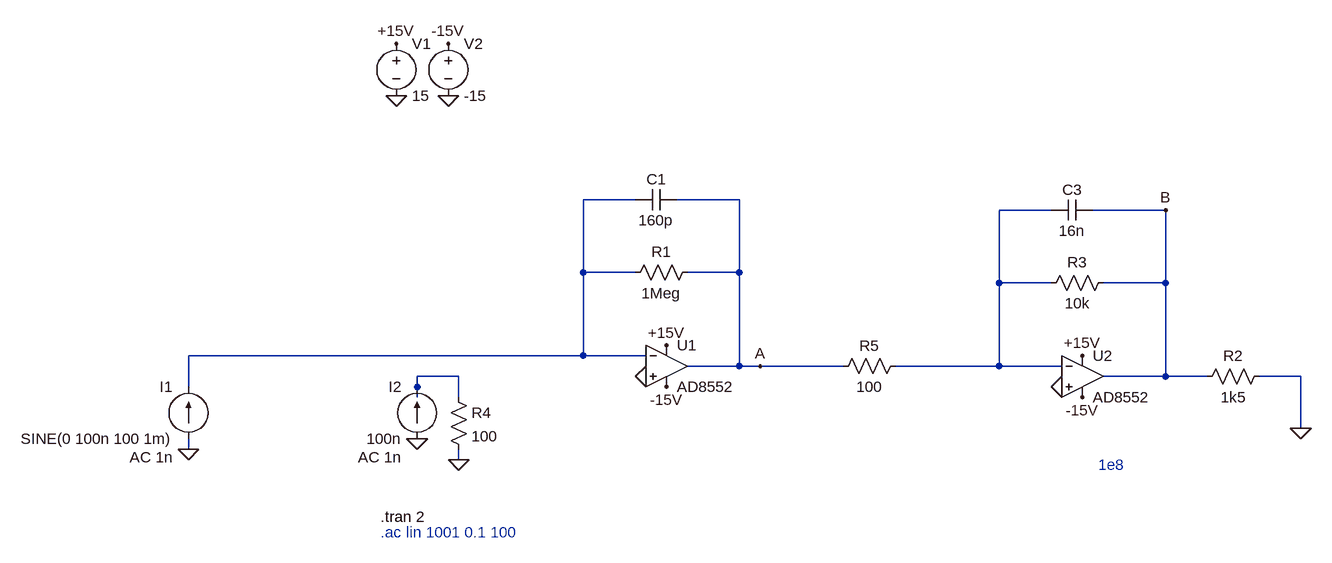
[diagram p0: schematic TIA1.asc]
TIA1.asc, the LTspice schematic file:
Version 4
SHEET 1 1732 1236
WIRE 256 128 176 128
WIRE 416 128 320 128
WIRE 896 144 816 144
WIRE 1072 144 960 144
WIRE 176 240 176 128
WIRE 256 240 176 240
WIRE 416 240 416 128
WIRE 416 240 336 240
WIRE 816 256 816 144
WIRE 896 256 816 256
WIRE 1072 256 1072 144
WIRE 1072 256 976 256
WIRE 176 368 176 240
WIRE 176 368 -432 368
WIRE 272 368 176 368
WIRE 416 384 416 240
WIRE 416 384 336 384
WIRE 448 384 416 384
WIRE 576 384 448 384
WIRE 816 384 816 256
WIRE 816 384 656 384
WIRE 912 384 816 384
WIRE -16 400 -80 400
WIRE 1072 400 1072 256
WIRE 1072 400 976 400
WIRE 1136 400 1072 400
WIRE 1280 400 1216 400
WIRE -432 416 -432 368
WIRE -80 416 -80 400
WIRE -80 432 -80 416
WIRE -16 432 -16 400
WIRE 1280 480 1280 400
WIRE -432 512 -432 496
WIRE -16 528 -16 512
FLAG -112 -32 0
FLAG -32 -32 0
FLAG 304 352 +15V
FLAG -112 -112 +15V
FLAG -32 -112 -15V
FLAG 304 416 -15V
FLAG 272 400 0
FLAG -432 512 0
FLAG 944 368 +15V
FLAG 944 432 -15V
FLAG 912 416 0
FLAG 448 384 A
FLAG 1072 144 B
FLAG -80 496 0
FLAG 1280 480 0
FLAG -16 528 0
SYMBOL OpAmps\\AD8552 304 320 R0
SYMATTR InstName U1
SYMBOL voltage -112 -128 R0
WINDOW 123 0 0 Left 0
WINDOW 39 0 0 Left 0
SYMATTR InstName V1
SYMATTR Value 15
SYMBOL voltage -32 -128 R0
WINDOW 123 0 0 Left 0
WINDOW 39 0 0 Left 0
SYMATTR InstName V2
SYMATTR Value -15
SYMBOL res 352 224 R90
WINDOW 0 0 56 VBottom 2
WINDOW 3 32 56 VTop 2
SYMATTR InstName R1
SYMATTR Value 1Meg
SYMBOL cap 320 112 R90
WINDOW 0 0 32 VBottom 2
WINDOW 3 32 32 VTop 2
SYMATTR InstName C1
SYMATTR Value 160p
SYMBOL current -432 496 R180
WINDOW 0 24 80 Left 2
WINDOW 3 24 0 Left 2
WINDOW 123 24 -28 Left 2
WINDOW 39 0 0 Left 0
SYMATTR InstName I1
SYMATTR Value SINE(0 100n 100 1m)
SYMATTR Value2 AC 1n
SYMBOL OpAmps\\AD8552 944 336 R0
SYMATTR InstName U2
SYMBOL res 992 240 R90
WINDOW 0 0 56 VBottom 2
WINDOW 3 32 56 VTop 2
SYMATTR InstName R3
SYMATTR Value 10k
SYMBOL cap 960 128 R90
WINDOW 0 0 32 VBottom 2
WINDOW 3 32 32 VTop 2
SYMATTR InstName C3
SYMATTR Value 16n
SYMBOL res 672 368 R90
WINDOW 0 0 56 VBottom 2
WINDOW 3 32 56 VTop 2
SYMATTR InstName R5
SYMATTR Value 100
SYMBOL current -80 496 R180
WINDOW 0 24 80 Left 2
WINDOW 3 24 0 Left 2
WINDOW 123 24 -28 Left 2
WINDOW 39 0 0 Left 0
SYMATTR InstName I2
SYMATTR Value 100n
SYMATTR Value2 AC 1n
SYMBOL res 1232 384 R90
WINDOW 0 0 56 VBottom 2
WINDOW 3 32 56 VTop 2
SYMATTR InstName R2
SYMATTR Value 1k5
SYMBOL res -32 416 R0
SYMATTR InstName R4
SYMATTR Value 100
TEXT -136 616 Left 2 !.tran 2
TEXT -136 640 Left 2 ;.ac lin 1001 0.1 100
TEXT 968 536 Left 2 ;1e8

The netlist it stands for:
* TIA1.asc
XU1 0 N001 +15V -15V A AD8552  ; pins In+ In- V+ V- OUT
V1 +15V 0 15
V2 -15V 0 -15
R1 A N001 1Meg
C1 A N001 160p
I1 0 N001 SINE(0 100n 100 1m) AC 1n
XU2 0 N002 +15V -15V B AD8552  ; pins In+ In- V+ V- OUT
R3 B N002 10k
C3 B N002 16n
R5 N002 A 100
I2 0 N003 100n AC 1n
R2 0 B 1k5
R4 N003 0 100
.tran 2
* .ac lin 1001 0.1 100
* 1e8
.backanno
.end